# EAGLE design RyanWalkowiakLab3 (EAGLE 9.6.2)
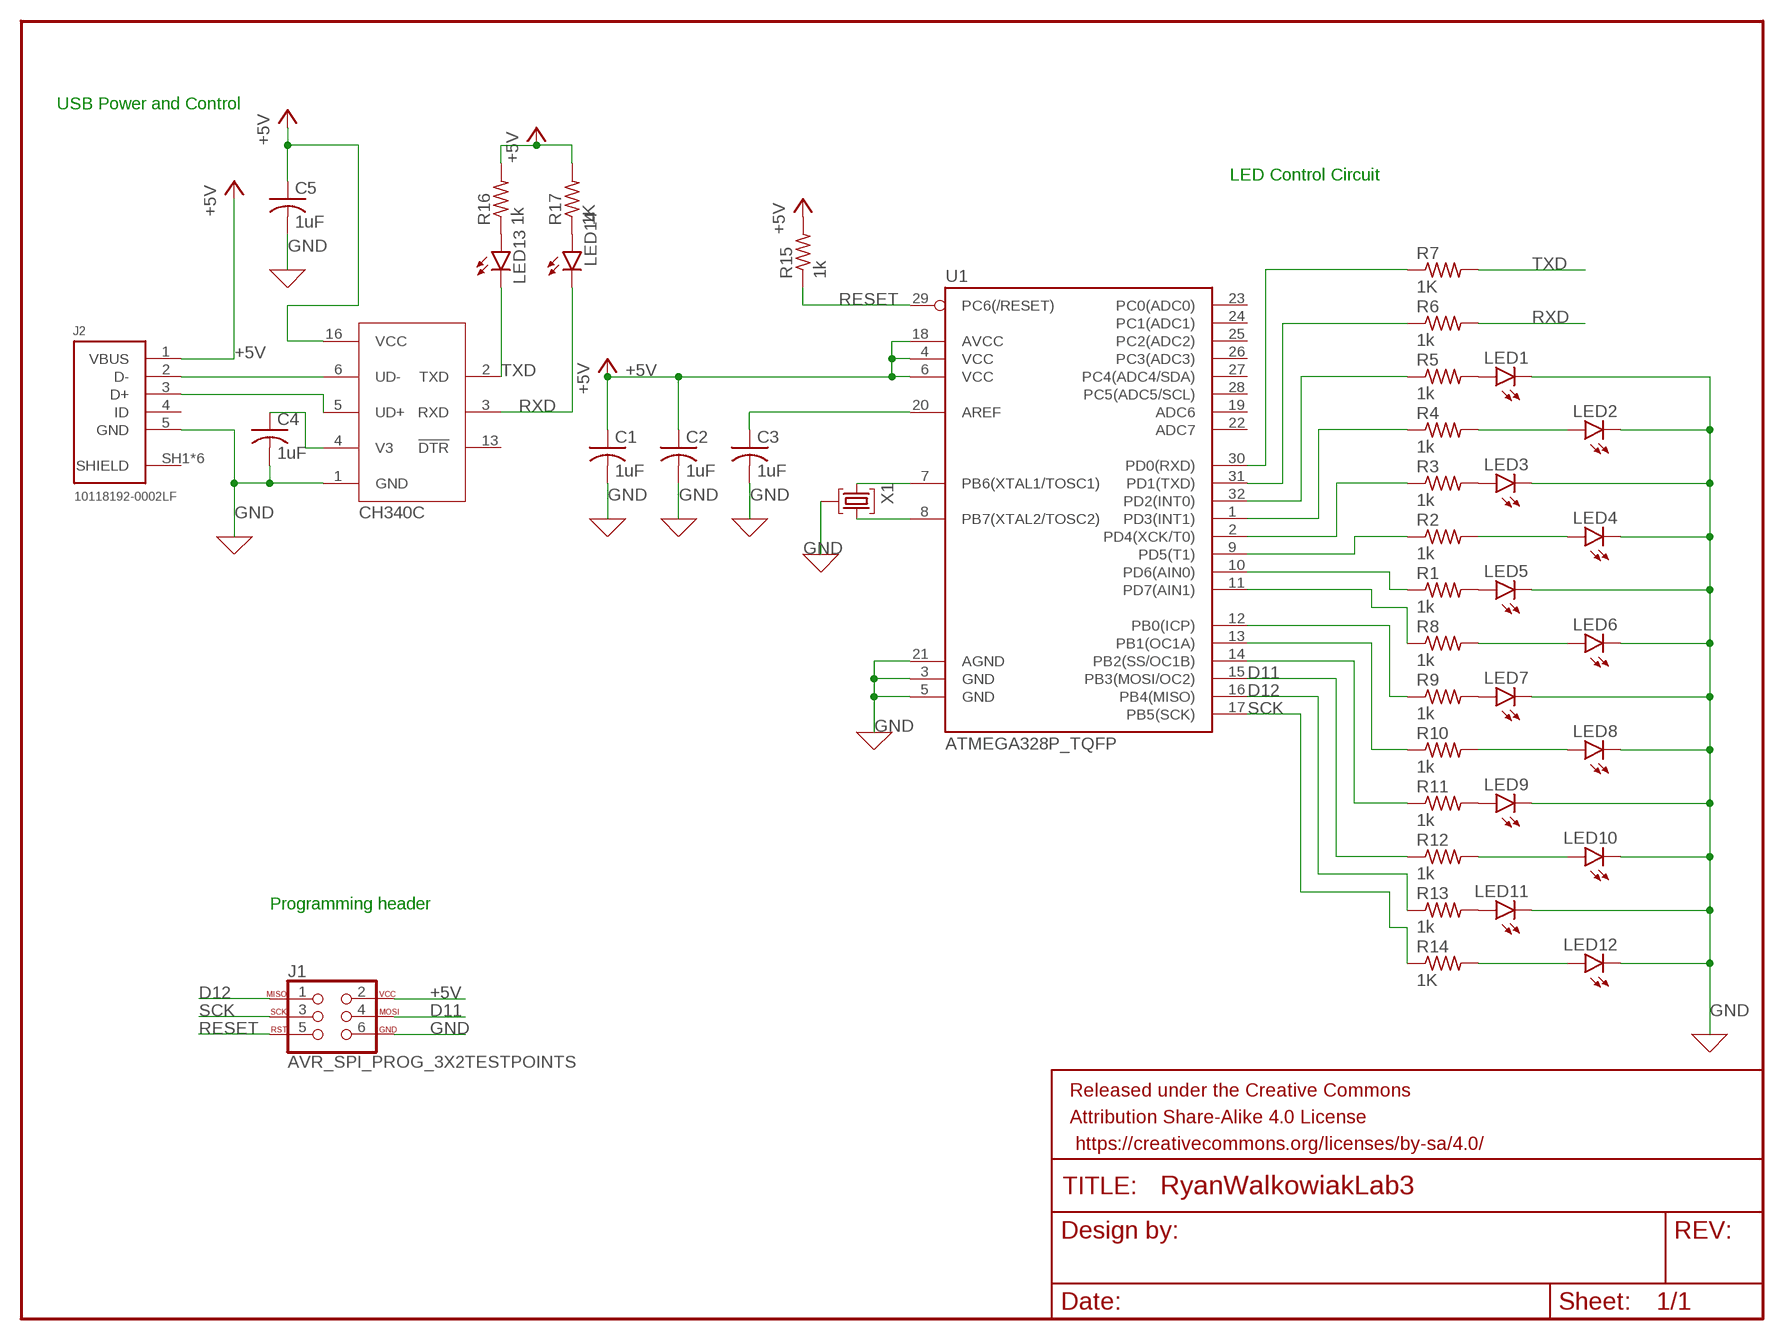
[diagram p0: schematic, sheet 1]

## Parts
C1  1uF  C-USC0805  [C0805]
C2  1uF  C-USC0805  [C0805]
C3  1uF  C-USC0805  [C0805]
C4  1uF  C-USC0805  [C0805]
C5  1uF  C-USC0805  [C0805]
FRAME1  FRAME-LETTERNO_PACKAGE  [DUMMY]
J1  AVR_SPI_PROG_3X2TESTPOINTS  [2X3_TEST_POINTS]
J2  10118192-0002LF  [10118192-0002LF]
LED1  LEDCHIP-LED0805  [CHIP-LED0805]
LED2  LEDCHIP-LED0805  [CHIP-LED0805]
LED3  LEDCHIP-LED0805  [CHIP-LED0805]
LED4  LEDCHIP-LED0805  [CHIP-LED0805]
LED5  LEDCHIP-LED0805  [CHIP-LED0805]
LED6  LEDCHIP-LED0805  [CHIP-LED0805]
LED7  LEDCHIP-LED0805  [CHIP-LED0805]
LED8  LEDCHIP-LED0805  [CHIP-LED0805]
LED9  LEDCHIP-LED0805  [CHIP-LED0805]
LED10  LEDCHIP-LED0805  [CHIP-LED0805]
LED11  LEDCHIP-LED0805  [CHIP-LED0805]
LED12  LEDCHIP-LED0805  [CHIP-LED0805]
LED13  LEDCHIP-LED0805  [CHIP-LED0805]
LED14  LEDCHIP-LED0805  [CHIP-LED0805]
R1  1k  R-US_R0805  [R0805]
R2  1k  R-US_R0805  [R0805]
R3  1k  R-US_R0805  [R0805]
R4  1k  R-US_R0805  [R0805]
R5  1k  R-US_R0805  [R0805]
R6  1k  R-US_R0805  [R0805]
R7  1K  R-US_R0805  [R0805]
R8  1k  R-US_R0805  [R0805]
R9  1k  R-US_R0805  [R0805]
R10  1k  R-US_R0805  [R0805]
R11  1k  R-US_R0805  [R0805]
R12  1k  R-US_R0805  [R0805]
R13  1k  R-US_R0805  [R0805]
R14  1K  R-US_R0805  [R0805]
R15  1k  R-US_R0805  [R0805]
R16  1k  R-US_R0805  [R0805]
R17  1K  R-US_R0805  [R0805]
U1  ATMEGA328P_TQFP  [TQFP32-08]
U$2  CH340C  [SOP-16]
X1  16Mhz  CSTCE16M0V53-R0  [CSTCE16M0V53-R0]

## Nets
+5V: C1.1 C2.1 C5.1 J1.2 J2.1(VBUS) R15.2 R16.2 R17.2 U1.4(VCC) U1.6(VCC) U1.18(AVCC) U$2.16(VCC)
D11: J1.4 R12.1 U1.15(PB3(MOSI/OC2))
D12: J1.1 R13.1 U1.16(PB4(MISO))
GND: C1.2 C2.2 C3.2 C4.2 C5.2 J1.6 J2.5(GND) LED1.C LED2.C LED3.C LED4.C LED5.C LED6.C LED7.C LED8.C LED9.C LED10.C LED11.C LED12.C U1.3(GND) U1.5(GND) U1.21(AGND) U$2.1(GND) X1.2(GND)
N$1: R7.1 U1.30(PD0(RXD))
N$2: R6.1 U1.31(PD1(TXD))
N$3: R5.1 U1.32(PD2(INT0))
N$4: R4.1 U1.1(PD3(INT1))
N$5: R3.1 U1.2(PD4(XCK/T0))
N$6: R2.1 U1.9(PD5(T1))
N$7: R1.1 U1.10(PD6(AIN0))
N$8: R8.1 U1.11(PD7(AIN1))
N$9: R9.1 U1.12(PB0(ICP))
N$10: R10.1 U1.13(PB1(OC1A))
N$11: R11.1 U1.14(PB2(SS/OC1B))
N$12: J2.2(D-) U$2.6(UD-)
N$13: J2.3(D+) U$2.5(UD+)
N$14: C4.1 U$2.4(V3)
N$15: LED1.A R5.2
N$16: LED3.A R3.2
N$17: LED5.A R1.2
N$18: LED7.A R9.2
N$19: LED9.A R11.2
N$20: LED11.A R13.2
N$21: LED2.A R4.2
N$23: C3.1 U1.20(AREF)
N$24: LED4.A R2.2
N$25: LED6.A R8.2
N$26: LED8.A R10.2
N$27: LED10.A R12.2
N$28: LED12.A R14.2
N$29: LED13.A R16.1
N$30: U1.7(PB6(XTAL1/TOSC1)) X1.1(INPUT)
N$31: U1.8(PB7(XTAL2/TOSC2)) X1.3(OUTPUT)
N$32: LED14.A R17.1
RESET: J1.5 R15.1 U1.29(PC6(/RESET))
RXD: LED14.C R6.2 U$2.3(RXD)
SCK: J1.3 R14.1 U1.17(PB5(SCK))
TXD: LED13.C R7.2 U$2.2(TXD)
Unconnected: J2.4(ID) U1.19(ADC6) U1.22(ADC7) U1.23(PC0(ADC0)) U1.24(PC1(ADC1)) U1.25(PC2(ADC2)) U1.26(PC3(ADC3)) U1.27(PC4(ADC4/SDA)) U1.28(PC5(ADC5/SCL)) U$2.13(!DTR)

## Notes on the sheet
- USB Power and Control
- LED Control Circuit
- Programming header

## Power pins joined to a net without a drawn wire
SHIELD: J2.SH1(SHIELD) J2.SH2(SHIELD) J2.SH3(SHIELD) J2.SH4(SHIELD) J2.SH5(SHIELD) J2.SH6(SHIELD)

## Library data of the parts
C1-C5 = rcl:C-US: CAPACITOR, American symbol; SPICEPREFIX: C
FRAME1 = SparkFun-Aesthetics:FRAME-LETTER: Schematic Frame - Letter Standard 8.5x11 US Letter frame; DESIGNER: Nobody; VERSION: v01
J1 = SparkFun-Connectors:AVR_SPI_PROG_3X2: AVR ISP 6 Pin This is the reduced ISP connector for AVR programming. Common on Arduino. This footprint will take up less PCB space and can be used with a 10-pin to 6-pin adapter such as SKU: BOB-08508 **Special note about "TEST_POINT" package. The stop mask is on the top side, so if you want your programming test points to be on the bottom of your board, make sure to place this package on the bottom side of the board. This also ensure that the orientation to program from the bottom side will be correct. SparkFun Products: SparkFun ISP Pogo Adapter <https://www.sparkfun.com/products/11591> - NS Tiny AVR Programmer <https://www.sparkfun.com/products/11801> -PTH
J2 = USB connector:10118192-0002LF: CONN RCPT USB2.0 MICRO B SMD R/A Manufacturer's datasheet <https://www.amphenol-icc.com/media/wysiwyg/files/drawing/10118192.pdf>; CREATED_BY: PCBLayout.com; DIGIKEY_PARTNO: 609-5379-2-ND; MANUFACTURER: Amphenol ICC (FCI); MPN: 10118192-0002LF
LED1-LED14 = led:LED: LED OSRAM: - CHIPLED LG R971, LG N971, LY N971, LG Q971, LY Q971, LO R971, LY R971 LH N974, LH R974 LS Q976, LO Q976, LY Q976 LO Q996 - Hyper CHIPLED LW Q18S LB Q993, LB Q99A, LB R99A - SideLED LS A670, LO A670, LY A670, LG A670, LP A670 LB A673, LV A673, LT A673, LW A673 LH A674 LY A675 LS A676, LA A676, LO A676, LY A676, LW A676 LS A679, LY A679, LG A679 - Hyper Micro SIDELED® LS Y876, LA Y876, LO Y876, LY Y876 LT Y87S - SmartLED LW L88C, LW L88S LB L89C, LB L89S, LG L890 LS L89K, LO L89K, LY L89K LS L896, LA L896, LO L896, LY L896 - TOPLED LS T670, LO T670, LY T670, LG T670, LP T670 LSG T670, LSP T670, LSY T670, LOP T670, LYG T670 LG T671, LOG T671, LSG T671 LB T673, LV T673, LT T673, LW T673 LH T674 LS T676, LA T676, LO T676, LY T676, LB T676, LH T676, LSB T676, LW T676 LB T67C, LV T67C, LT T67C, LS T67K, LO T67K, LY T67K, LW E67C LS E67B, LA E67B, LO E67B, LY E67B, LB E67C, LV E67C, LT E67C LW T67C LS T679, LY T679, LG T679 LS T770, LO T770, LY T770, LG T770, LP T770 LB T773, LV T773, LT T773, LW T773 LH T774 LS E675, LA E675, LY E675, LS T675 LS T776, LA T776, LO T776, LY T776, LB T776 LHGB T686 LT T68C, LB T68C - Hyper Mini TOPLED® LB M676 - Mini TOPLED Santana® LG M470 LS M47K, LO M47K, LY M47K Source: http://www.osram.convergy.de LUXEON: - LUMILED® LXK2-PW12-R00, LXK2-PW12-S00, LXK2-PW14-U00, LXK2-PW14-V00 LXK2-PM12-R00, LXK2-PM12-S00, LXK2-PM14-U00 LXK2-PE12-Q00, LXK2-PE12-R00, LXK2-PE12-S00, LXK2-PE14-T00, LXK2-PE14-U00 LXK2-PB12-K00, LXK2-PB12-L00, LXK2-PB12-M00, LXK2-PB14-N00, LXK2-PB14-P00, LXK2-PB14-Q00 LXK2-PR12-L00, LXK2-PR12-M00, LXK2-PR14-Q00, LXK2-PR14-R00 LXK2-PD12-Q00, LXK2-PD12-R00, LXK2-PD12-S00 LXK2-PH12-R00, LXK2-PH12-S00 LXK2-PL12-P00, LXK2-PL12-Q00, LXK2-PL12-R00 Source: www.luxeon.com KINGBRIGHT: KA-3528ASYC Source: www.kingbright.com
R1-R17 = rcl:R-US_: RESISTOR, American symbol; SPICEPREFIX: R
U1 = SparkFun-IC-Microcontroller:ATMEGA328P_TQFP: Popular 328P in QFP Storefront component: ATmega328 - TQFP <https://www.sparkfun.com/products/13448> (COM-13448) Datasheet <http://www.sparkfun.com/datasheets/Components/SMD/ATMega328.pdf> SparkFun Products SparkFun RedBoard - Programmed with Arduino <https://www.sparkfun.com/products/12757> (DEV-12757) Arduino Pro Mini 328 - 5V/16MHz <https://www.sparkfun.com/products/11113> (DEV-11113) Arduino Pro Mini 328 - 3.3V/8MHz <https://www.sparkfun.com/products/11114> (DEV-11114) SparkFun OpenLog <https://www.sparkfun.com/products/13712> (DEV-13712) SparkFun MicroView - OLED Arduino Module <https://www.sparkfun.com/products/12923> (DEV-12923) SparkFun Digital Sandbox <https://www.sparkfun.com/products/12651> (DEV-12651) SparkFun PicoBoard <https://www.sparkfun.com/products/11888> (WIG-11888) Arduino Fio <https://www.sparkfun.com/products/10116> (DEV-10116) LilyPad Arduino 328 Main Board <https://www.sparkfun.com/products/13342> (DEV-13342) SparkFun RedStick <https://www.sparkfun.com/products/13741> (DEV-13741) LilyPad MP3 <https://www.sparkfun.com/products/11013> (DEV-11013) LilyPad Arduino SimpleSnap <https://www.sparkfun.com/products/10941> (DEV-10941) SparkFun Stepoko <https://www.sparkfun.com/products/13899> (ROB-13899) SparkFun Geiger Counter <https://www.sparkfun.com/products/11345> (SEN-11345) SparkFun EL Sequencer <https://www.sparkfun.com/products/12781> (COM-12781) Arduino Pro 328 - 5V/16MHz <https://www.sparkfun.com/products/10915> (DEV-10915) CryptoCape <https://www.sparkfun.com/products/12773> (DEV-12773) SparkFun IR Thermometer Evaluation Board - MLX90614 <https://www.sparkfun.com/products/10740> (SEN-10740) SparkFun RedBot Mainboard <https://www.sparkfun.com/products/12097> (ROB-12097) Arduino Pro 328 - 3.3V/8MHz <https://www.sparkfun.com/products/10914> (DEV-10914) SparkFun Block for Intel® Edison - Arduino <https://www.sparkfun.com/products/13036> (DEV-13036) SparkFun Simon Says - Surface Mount Soldering Kit <https://www.sparkfun.com/products/10935> (KIT-10935) SparkFun 7-Segment Serial Display - Red <https://www.sparkfun.com/products/11441> (COM-11441) SparkFun 7-Segment Serial Display - White <https://www.sparkfun.com/products/11629> (COM-11629) SparkFun 7-Segment Serial Display - Yellow <https://www.sparkfun.com/products/11443> (COM-11443) SparkFun 7-Segment Serial Display - Kelly Green <https://www.sparkfun.com/products/11440> (COM-11440) SparkFun 7-Segment Serial Display - Blue <https://www.sparkfun.com/products/11442> (COM-11442) SparkFun OpenSegment Serial Display - 20mm (Blue) <https://www.sparkfun.com/products/11647> (COM-11647) SparkFun OpenSegment Serial Display - 20mm (Green) <https://www.sparkfun.com/products/11646> (COM-11646) SparkFun OpenSegment Serial Display - 20mm (White) <https://www.sparkfun.com/products/11648> (COM-11648) SparkFun OpenSegment Serial Display - 20mm (Red) <https://www.sparkfun.com/products/11644> (COM-11644) SparkFun OpenSegment Serial Display - 20mm (Yellow) <https://www.sparkfun.com/products/11645> (COM-11645) SparkFun OpenSegment Shield <https://www.sparkfun.com/products/13190> (DEV-13190); PROD_ID: IC-09069
U$2 = Library of stuff:CH340C: CH340C USB to UART IC
X1 = Crystals_Oscillators:CSTCE16M0V53-R0: CER RES 16.0000MHZ 15PF SMD Manufacturer's datasheet <https://www.murata.com/~/media/webrenewal/support/library/catalog/products/timingdevice/ceralock/p16e.ashx>; CREATED_BY: PCBLayout.com; DIGIKEY_PART_NUMBER: 490-1198-2-ND; MANUFACTURER: Murata Electronics North America; MPN: CSTCE16M0V53-R0; PACKAGE: SMD 3

## Board
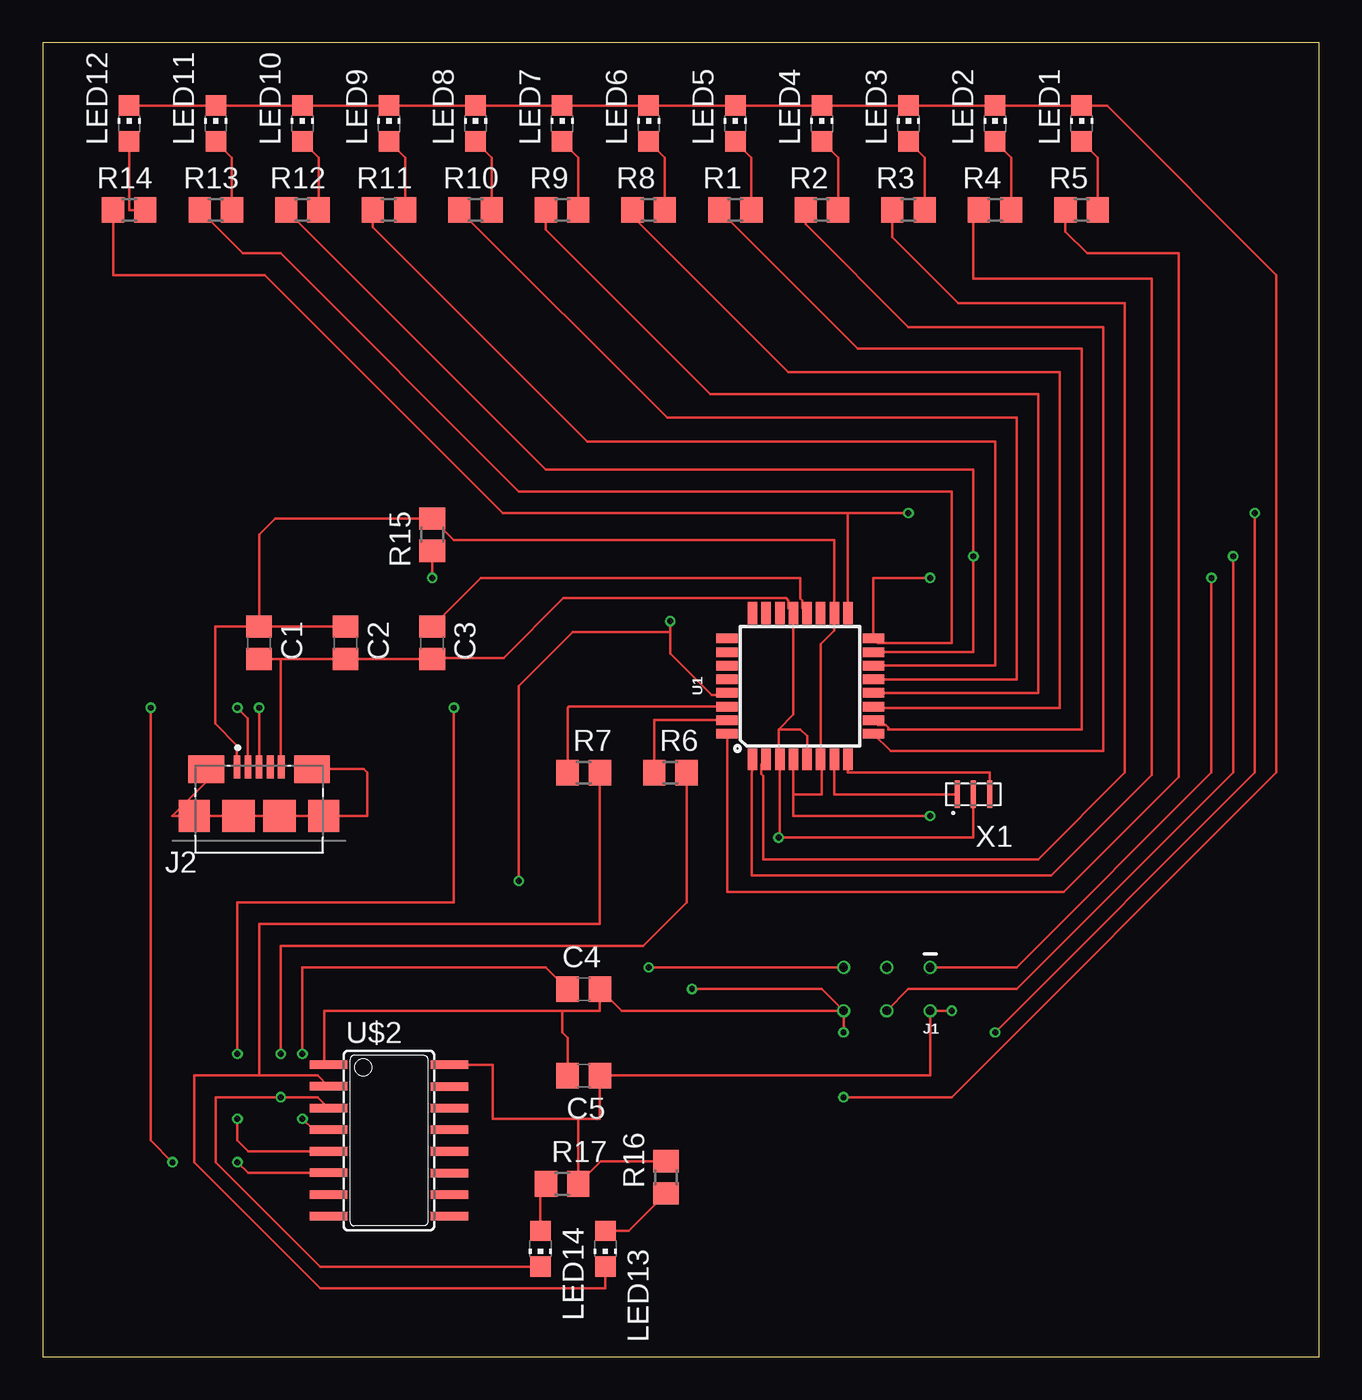
[diagram p1: board, top side]
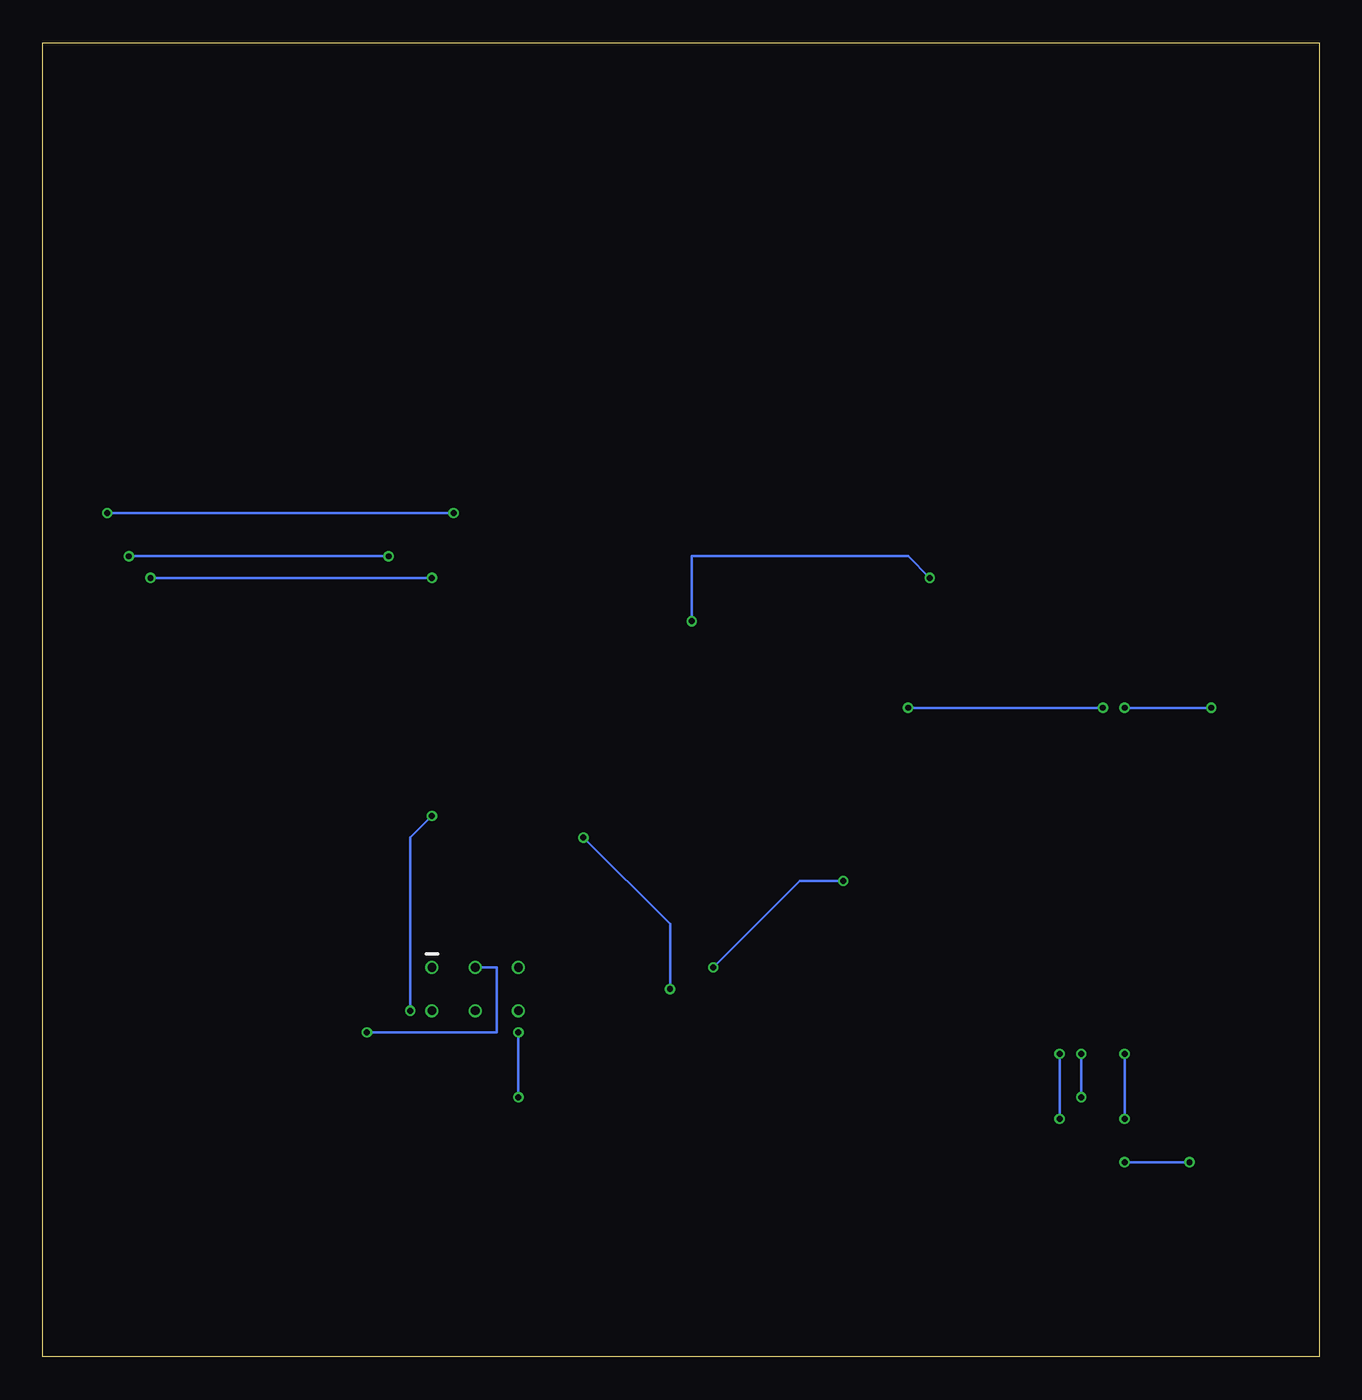
[diagram p2: board, bottom side, seen from below]

Size 74.91 x 77.14 mm. Coordinates in mm from the lower left corner, seen from the top.
Outline: 0,0 74.91,0 74.91,77.14 0,77.14 0,0
Copper layers (1*16): Top 0.035559375mm / dielectric 1.6mm / Bottom 0.035559375mm
Design rules "oshpark-2layer": minimum track width 6mil, minimum drill 10mil, track to track 6mil, track to pad 6mil, pad to pad 6mil, via to via 6mil, smd to smd 6mil, copper to edge 15mil, drill to drill 6mil, minimum pad ring 5mil, minimum via ring 5mil, stop-mask expansion 2.5mil, vias tented up to drill 0mil, thermal gap 10mil

### Footprints (pad centres in the part's own frame; a part is rotated, then mirrored left to right if it is on the bottom)
C0805 = smd 1.3 x 1.5: 1 -0.95,0; 2 0.95,0
2X3_TEST_POINTS = drill 0.508: 1 -2.54,-1.27; 2 -2.54,1.27; 3 0,-1.27; 4 0,1.27; 5 2.54,-1.27; 6 2.54,1.27
10118192-0002LF = smd 0.4 x 1.35: 1 -1.3,2.875; 2 -0.65,2.875; 3 0,2.875; 4 0.65,2.875; 5 1.3,2.875 | smd 2.1 x 1.6: SH1 -3.1,2.75; SH2 3.1,2.75 | smd 1.8 x 1.9: SH3 -3.8,0; SH4 3.8,0 | smd 1.9 x 1.9: SH5 -1.2,0; SH6 1.2,0
CHIP-LED0805 = smd 1.2 x 1.2: A 0,-1.05; C 0,1.05
R0805 = smd 1.3 x 1.5: 1 -0.95,0; 2 0.95,0
TQFP32-08 = smd 1.27 x 0.559: 1 -4.293,2.8; 2 -4.293,2; 3 -4.293,1.2; 4 -4.293,0.4; 5 -4.293,-0.4; 6 -4.293,-1.2; 7 -4.293,-2; 8 -4.293,-2.8; 17 4.293,-2.8; 18 4.293,-2; 19 4.293,-1.2; 20 4.293,-0.4; 21 4.293,0.4; 22 4.293,1.2; 23 4.293,2; 24 4.293,2.8 | smd 0.559 x 1.27: 9 -2.8,-4.293; 10 -2,-4.293; 11 -1.2,-4.293; 12 -0.4,-4.293; 13 0.4,-4.293; 14 1.2,-4.293; 15 2,-4.293; 16 2.8,-4.293; 25 2.8,4.293; 26 2,4.293; 27 1.2,4.293; 28 0.4,4.293; 29 -0.4,4.293; 30 -1.2,4.293; 31 -2,4.293; 32 -2.8,4.293
SOP-16 = smd 0.5 x 2.2: 1 -4.445,-3.55; 2 -3.185,-3.55; 3 -1.915,-3.55; 4 -0.645,-3.55; 5 0.635,-3.55; 6 1.895,-3.55; 7 3.165,-3.55; 8 4.435,-3.55; 9 4.445,3.55; 10 3.175,3.55; 11 1.905,3.55; 12 0.635,3.55; 13 -0.635,3.55; 14 -1.905,3.55; 15 -3.175,3.55; 16 -4.445,3.55
CSTCE16M0V53-R0 = smd 0.3 x 1.6: 1 0.95,0; 2 0,0; 3 -0.95,0

### Placement (x,y rotation side)
C1  12.7,41.91 270 top
C2  17.78,41.91 270 top
C3  22.86,41.91 270 top
C4  31.75,21.59 0 top
C5  31.75,16.51 180 top
FRAME1  -63.5,11.43 0 top  (outside the outline)
J1  49.53,21.59 180 top
J2  12.7,31.75 0 top
LED1  60.96,72.39 0 top
LED2  55.88,72.39 0 top
LED3  50.8,72.39 0 top
LED4  45.72,72.39 0 top
LED5  40.64,72.39 0 top
LED6  35.56,72.39 0 top
LED7  30.48,72.39 0 top
LED8  25.4,72.39 0 top
LED9  20.32,72.39 0 top
LED10  15.24,72.39 0 top
LED11  10.16,72.39 0 top
LED12  5.08,72.39 0 top
LED13  33.02,6.35 180 top
LED14  29.21,6.35 180 top
R1  40.64,67.31 0 top
R2  45.72,67.31 0 top
R3  50.8,67.31 0 top
R4  55.88,67.31 0 top
R5  60.96,67.31 0 top
R6  36.83,34.29 0 top
R7  31.75,34.29 0 top
R8  35.56,67.31 0 top
R9  30.48,67.31 0 top
R10  25.4,67.31 0 top
R11  20.32,67.31 0 top
R12  15.24,67.31 0 top
R13  10.16,67.31 0 top
R14  5.08,67.31 0 top
R15  22.86,48.26 90 top
R16  36.58,10.54 90 top
R17  30.48,10.16 0 top
U1  44.45,39.37 90 top
U$2  20.32,12.7 270 top
X1  54.61,33.02 180 top

### Tracks (layer width: path | path; a pad name or v marks a point on that pad's centre or on a via)
+5V  (via drill 0.35)
  Top 0.152: J2.1 11.4,35.89 10.13,37.17 10.13,42.86 C1.1 | C2.1 C1.1 | U1.4 44.05,33.02 | 44.05,33.02 45.72,33.02 45.72,35.01 U1.6 45.65,41.84 46.45,42.64 U1.18 46.45,47.94 24.13,47.94 R15.2 13.65,49.21 12.7,48.26 C1.1 | v53.34,20.32 J1.2 52.07,16.51 C5.1 32.7,13.97 31.43,13.97 | 31.43,13.97 R17.2 32.76,11.49 R16.2 | 31.43,13.97 26.41,13.97 26.41,17.15 U$2.16 | 44.05,33.02 44.05,31.75 v52.07,31.75
  Bottom 0.152: v52.07,31.75 53.34,30.48 v53.34,20.32
D11  (via drill 0.35)
  Top 0.152: R12.1 29.53,52.07 54.61,52.07 v54.61,46.99 54.61,41.37 U1.15 | v69.85,46.99 69.85,34.29 57.15,21.59 50.8,21.59 J1.4
  Bottom 0.152: v69.85,46.99 v54.61,46.99
D12  (via drill 0.35)
  Top 0.152: R13.1 11.75,64.77 13.97,64.77 27.94,50.8 53.34,50.8 53.34,41.91 49,41.91 U1.16 48.74,45.72 v52.07,45.72 | J1.1 57.15,22.86 68.58,34.29 v68.58,45.72
  Bottom 0.152: v52.07,45.72 v68.58,45.72
GND  (via drill 0.35)
  Top 0.152: LED12.C LED11.C LED10.C LED9.C LED8.C LED7.C LED6.C LED5.C LED4.C LED3.C LED2.C LED1.C 62.45,73.44 72.39,63.5 72.39,34.29 53.34,15.24 v46.99,15.24 | 13.97,40.96 C2.2 C3.2 22.92,41.02 27.05,41.02 30.56,44.53 43.62,44.53 43.76,44.39 43.76,43.95 U1.21 44.05,37.7 43.18,36.83 | C1.2 13.97,40.96 | J1.6 33.97,20.32 C4.2 32.7,20.32 30.48,20.32 | 30.48,20.32 16.51,20.32 16.51,17.41 U$2.1 | v46.99,19.05 J1.6 | X1.2 54.61,30.48 v43.18,30.48 43.25,30.55 U1.3 43.18,35.15 43.18,36.83 | J1.6 45.72,21.59 v38.1,21.59 | 43.18,36.83 44.45,36.83 44.85,36.43 U1.5 | J2.5 13.97,34.66 13.97,40.96 | C5.2 30.8,18.73 30.48,19.05 30.48,20.32
  Bottom 0.152: v46.99,19.05 v46.99,15.24 | v43.18,30.48 38.1,25.4 v38.1,21.59
N$1
  Top 0.152: R7.1 30.8,38.1 30.87,38.17 U1.30
N$2
  Top 0.152: R6.1 35.88,37.37 U1.31
N$3
  Top 0.152: R5.1 60.01,66.04 61.28,64.77 66.65,64.77 66.65,34.04 59.92,27.3 40.16,27.3 U1.32
N$4
  Top 0.152: U1.1 41.65,34.39 41.61,34.34 41.61,28.27 59.18,28.27 65.08,34.16 65.08,63.3 54.61,63.3 54.61,66.99 R4.1
N$5
  Top 0.152: R3.1 49.85,65.72 53.72,61.85 63.5,61.85 63.5,34.29 58.42,29.21 42.29,29.21 42.29,34.09 42.16,34.22 42.16,34.78 U1.2
N$6
  Top 0.152: R2.1 44.77,66.48 50.8,60.45 62.23,60.45 62.23,35.56 49.75,35.56 U1.9
N$7
  Top 0.152: R1.1 47.82,59.18 60.96,59.18 60.96,36.83 49.61,36.83 49.61,36.94 49.47,37.08 49.03,37.08 U1.10
N$8
  Top 0.152: R8.1 34.61,66.93 43.75,57.78 59.69,57.78 59.69,38.1 48.74,38.1 U1.11
N$9
  Top 0.152: R9.1 29.53,66.17 39.18,56.52 58.42,56.52 58.42,38.97 U1.12
N$10
  Top 0.152: R10.1 36.64,55.12 57.15,55.12 57.15,39.77 U1.13
N$11
  Top 0.152: R11.1 19.37,66.29 31.94,53.72 55.88,53.72 55.88,40.57 U1.14
N$12  (via drill 0.35)
  Top 0.152: U$2.6 12.05,10.8 v11.43,11.43 | v6.35,38.1 6.35,12.7 v7.62,11.43 | v11.43,38.1 12.05,37.48 J2.2
  Bottom 0.152: v11.43,11.43 v7.62,11.43 | v6.35,38.1 v11.43,38.1
N$13  (via drill 0.35)
  Top 0.152: U$2.5 12.06,12.06 11.43,12.7 v11.43,13.97 | v24.13,38.1 24.13,26.67 11.43,26.67 v11.43,17.78 | J2.3 v12.7,38.1
  Bottom 0.152: v12.7,38.1 v24.13,38.1 | v11.43,13.97 v11.43,17.78
N$14  (via drill 0.35)
  Top 0.152: U$2.4 16.51,13.34 15.89,13.34 15.86,13.34 v15.24,13.97 | C4.1 29.53,22.86 15.24,22.86 v15.24,17.78
  Bottom 0.152: v15.24,17.78 v15.24,13.97
N$15
  Top 0.152: LED1.A 61.91,70.39 R5.2
N$16
  Top 0.152: LED3.A 51.75,70.39 R3.2
N$17
  Top 0.152: LED5.A 41.59,70.39 R1.2
N$18
  Top 0.152: LED7.A 31.43,70.39 R9.2
N$19
  Top 0.152: LED9.A 21.27,70.39 R11.2
N$20
  Top 0.152: LED11.A 11.11,70.39 R13.2
N$21
  Top 0.152: LED2.A 56.83,70.39 R4.2
N$23
  Top 0.152: U1.20 44.56,43.95 44.56,44.39 44.45,44.5 44.45,45.72 25.72,45.72 C3.1
N$24
  Top 0.152: LED4.A 46.67,70.39 R2.2
N$25
  Top 0.152: LED6.A 36.51,70.39 R8.2
N$26
  Top 0.152: LED8.A 26.35,70.39 R10.2
N$27
  Top 0.152: LED10.A 16.19,70.39 R12.2
N$28
  Top 0.152: LED12.A 5.08,67.31 R14.2
N$29
  Top 0.152: R16.1 34.39,7.4 LED13.A
N$30
  Top 0.152: X1.1 46.45,33.02 U1.7
N$31
  Top 0.152: U1.8 47.25,34.29 55.56,34.29 X1.3
N$32
  Top 0.152: R17.1 29.21,9.84 LED14.A
RESET  (via drill 0.35)
  Top 0.152: v22.86,45.72 R15.1 | v36.83,43.18 36.83,42.55 | 36.83,42.55 36.83,41.28 39.26,38.84 40.03,38.84 U1.29 | 36.83,42.55 31.11,42.55 27.94,39.37 v27.94,27.94 | v35.56,22.86 J1.5
  Bottom 0.152: v22.86,45.72 24.13,46.99 36.83,46.99 v36.83,43.18 | v35.56,22.86 30.48,27.94 v27.94,27.94
RXD  (via drill 0.35)
  Top 0.152: LED14.C 16.29,5.3 10.16,11.43 10.16,15.24 v13.97,15.24 16.14,15.24 U$2.3 | R6.2 37.78,26.67 35.24,24.13 13.97,24.13 v13.97,17.78
  Bottom 0.152: v13.97,17.78 v13.97,15.24
SCK  (via drill 0.35)
  Top 0.152: R14.1 4.13,63.5 13.02,63.5 26.99,49.53 47.25,49.53 | 47.25,49.53 U1.17 | v50.8,49.53 47.25,49.53 | v71.12,49.53 71.12,34.29 v55.88,19.05
  Bottom 0.152: v50.8,49.53 v71.12,49.53 | v55.88,19.05 48.26,19.05 48.26,22.86 J1.3
SHIELD
  Top 0.152: J2.SH1 9.6,33.73 7.62,31.75 J2.SH3 J2.SH5 J2.SH6 J2.SH4 19.05,31.75 19.05,34.29 18.84,34.5 J2.SH2
TXD
  Top 0.152: LED13.C 33.02,4.03 16.29,4.03 8.89,11.43 8.89,16.51 12.7,16.51 | 12.7,16.51 16.14,16.51 U$2.2 | R7.2 32.7,25.4 12.7,25.4 12.7,16.51